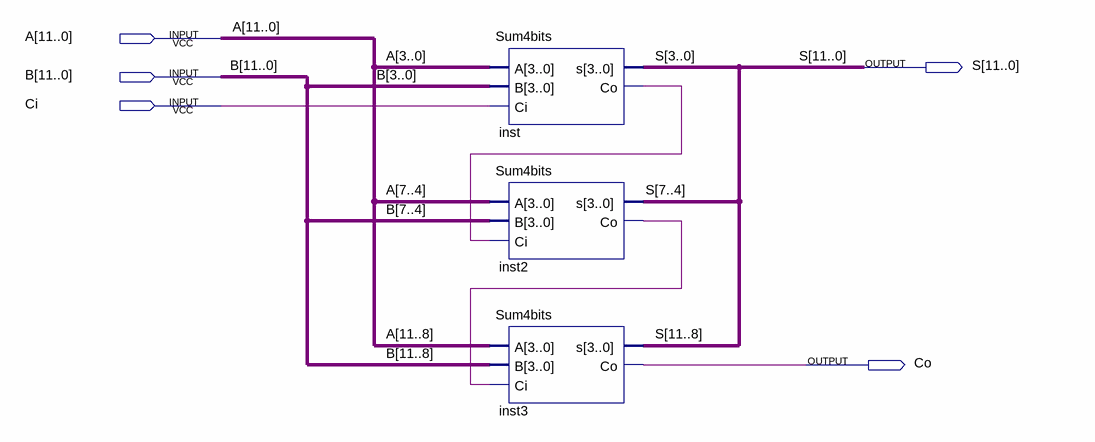
[diagram p0: schematic sheet]
// Quartus schematic Sum12bits.bdf as structural Verilog: 3 symbols, 5 pins
module Sum12bits (
  input  [11:0] A,
  input  [11:0] B,
  input  Ci,
  output [11:0] S,
  output Co
);

  wire inst2_co, inst_co;

  Sum4bits inst (.A(A[3:0]), .B(B[3:0]), .Ci(Ci), .s(S[3:0]), .Co(inst_co));
  Sum4bits inst2 (.A(A[7:4]), .B(B[7:4]), .Ci(inst_co), .s(S[7:4]), .Co(inst2_co));
  Sum4bits inst3 (.A(A[11:8]), .B(B[11:8]), .Ci(inst2_co), .s(S[11:8]), .Co(Co));
endmodule
